# EasyEDA Pro project 智能家居1.eprj

# Schematic Smarthome
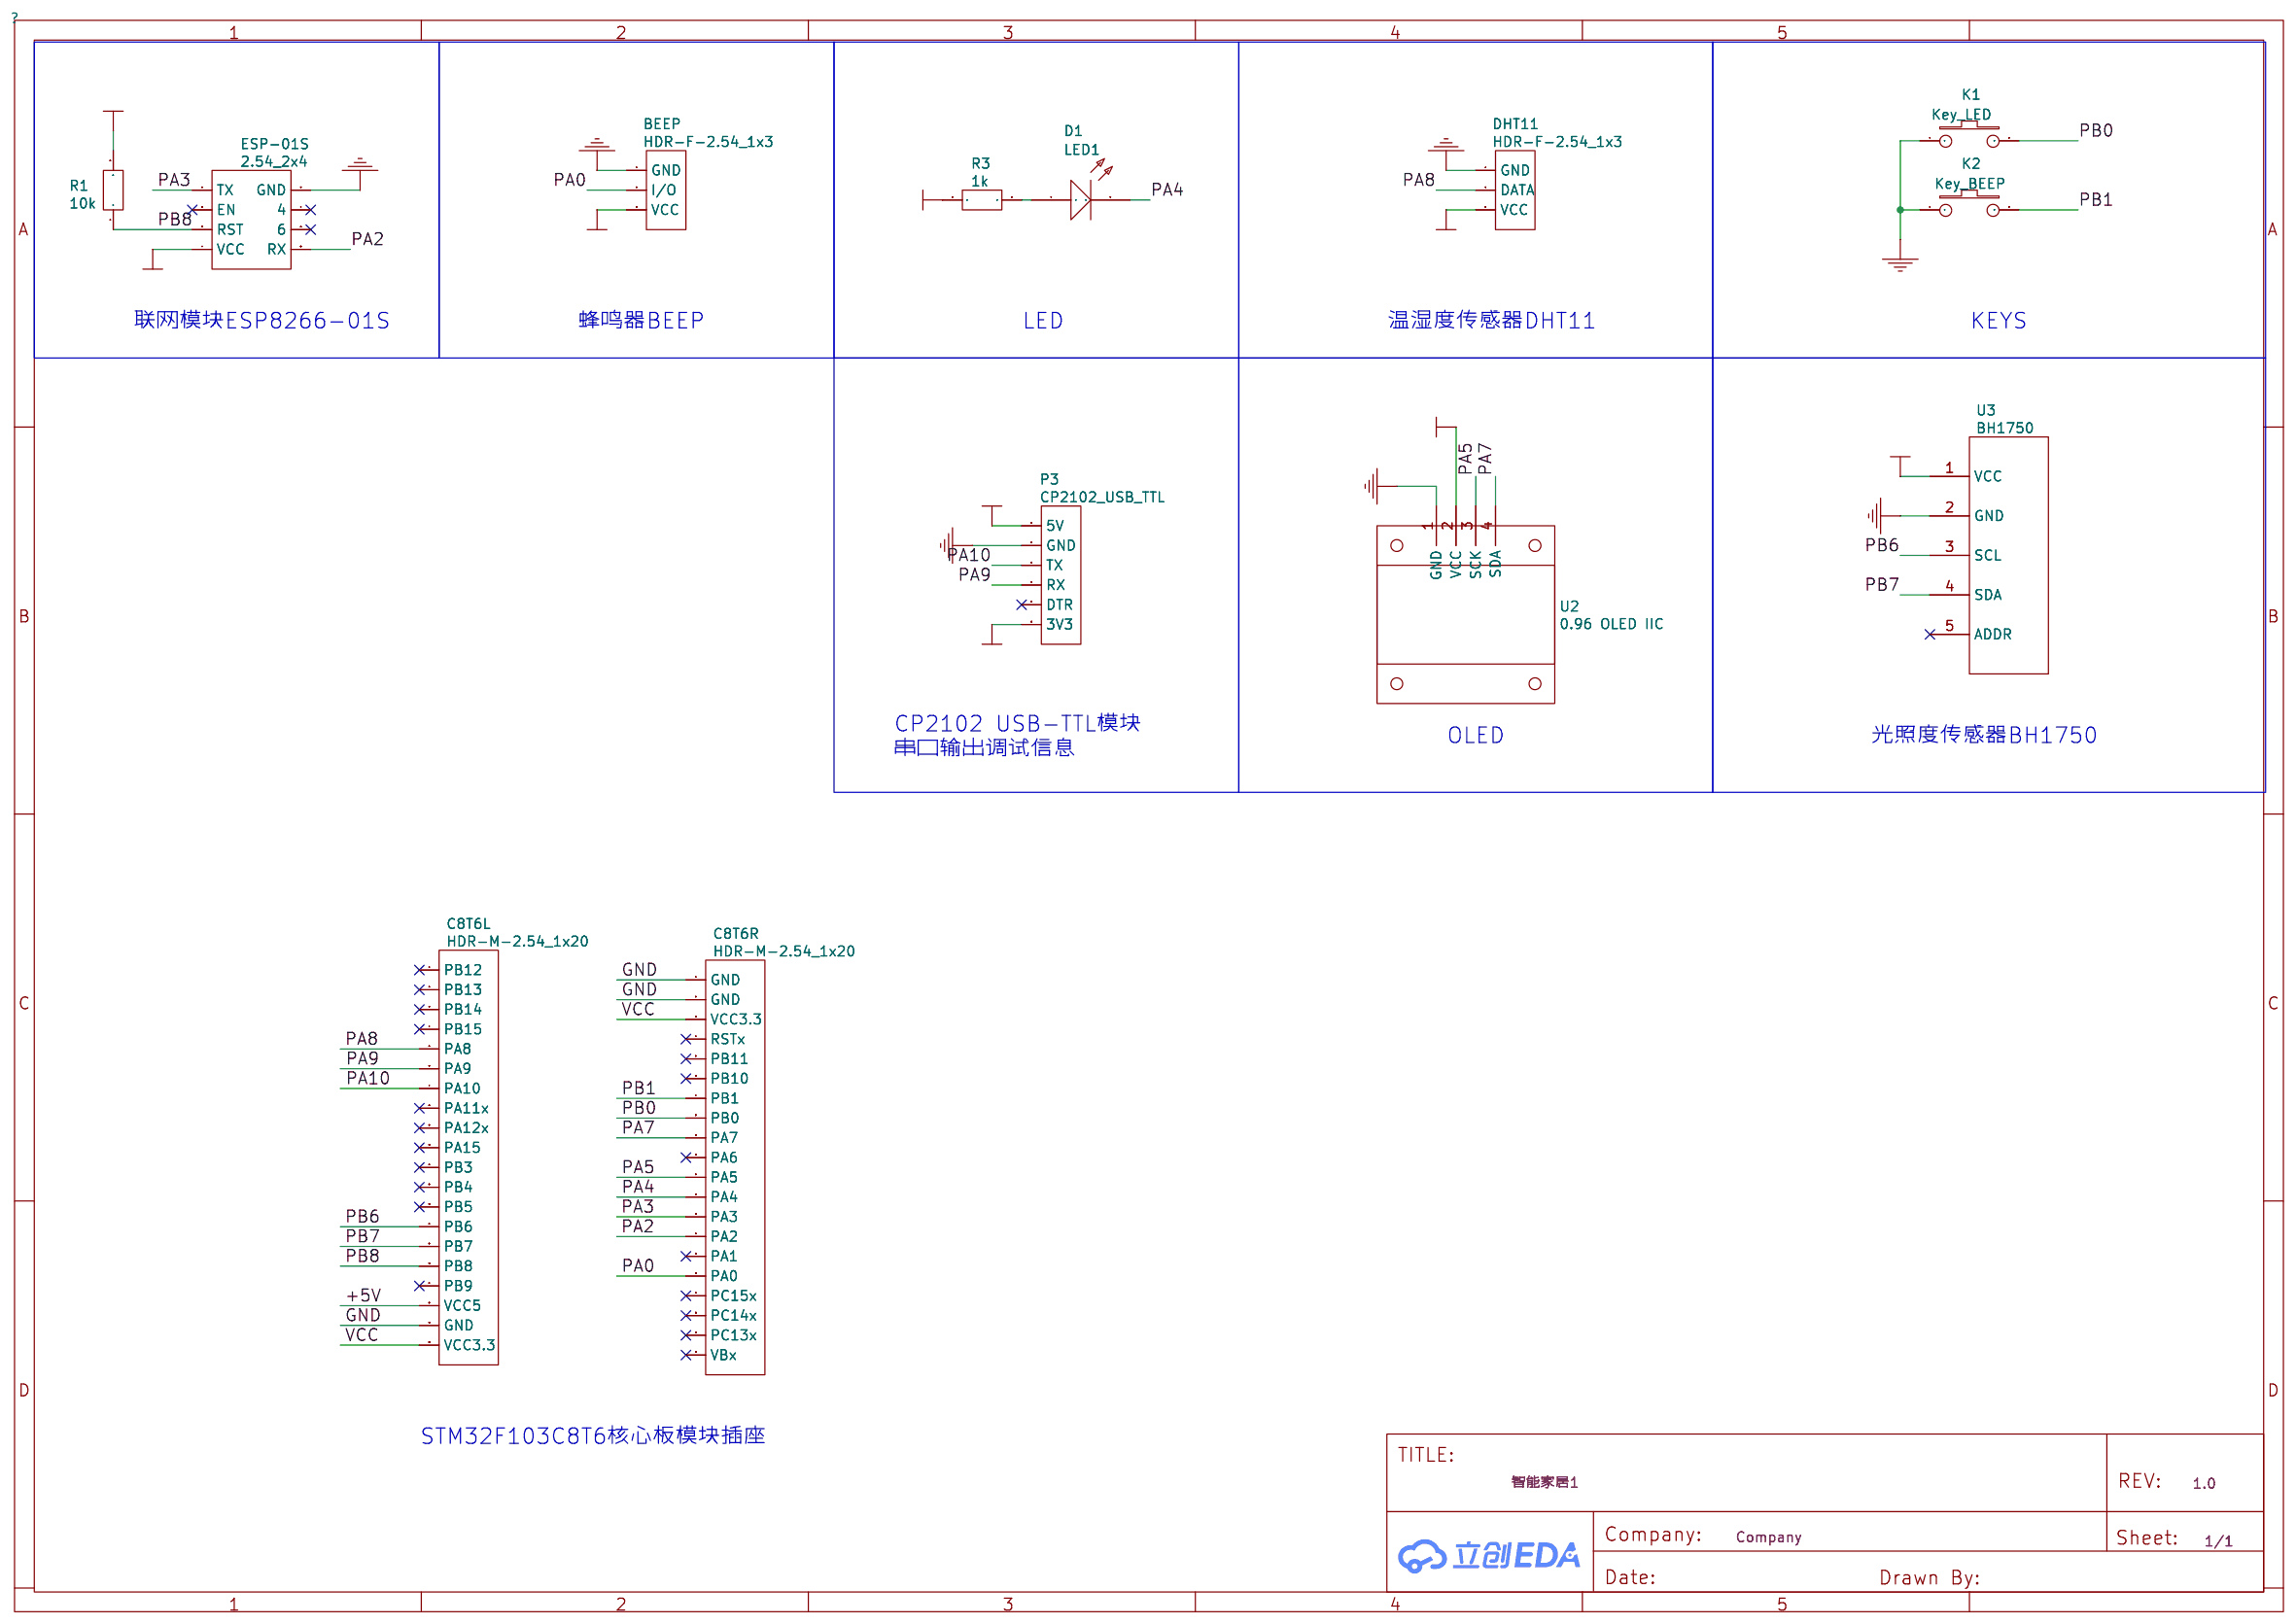
[diagram p0: schematic sheet]

## Parts
BEEP  HDR-F-2.54_1x3
C8T6L  HDR-M-2.54_1x20
C8T6R  HDR-M-2.54_1x20
D1  LED1
DHT11  HDR-F-2.54_1x3
ESP-01S  2.54_2x4
K1  Key_LED
K2  Key_BEEP
P3  CP2102_USB_TTL
R1  10k
R3  1k
U2  0.96 OLED IIC
U3  BH1750

## Library data of the parts
BEEP DHT11 = HDR-F-2.54_1x3: Supplier Part: C146690; Supplier: LCSC
C8T6L C8T6R = HDR-M-2.54_1x20: Supplier: LCSC; Manufacturer: BOOMELE; Manufacturer Part: 2.54mm 1*20P Female header; Supplier Part: C50984
D1 = LED1
ESP-01S = 2.54_2x4: Supplier Part: C239344; Supplier: LCSC
K1 = Key_LED
K2 = Key_BEEP
P3 = CP2102_USB_TTL: Supplier: LCSC; Manufacturer: BOOMELE; Manufacturer Part: Female header 1*6p; Supplier Part: C40877
R1 = 10k
R3 = 1k
U2 = 0.96 OLED IIC: Manufacturer Part: 0.96 OLED
U3 = BH1750

## Nets
+5V: C8T6L.18(VCC5) P3.1(5V)
GND: BEEP.1(GND) C8T6L.19(GND) C8T6R.1(GND) C8T6R.2(GND) DHT11.1(GND) ESP-01S.2(GND) K1.1 K2.1 P3.2(GND) U2.1(GND) U3.2(GND)
VCC: BEEP.3(VCC) C8T6L.20(VCC3.3) C8T6R.3(VCC3.3) DHT11.3(VCC) ESP-01S.7(VCC) P3.6(3V3) R1.2 R3.1 U2.2(VCC) U3.1(VCC)
PA0: BEEP.2(I/O) C8T6R.16(PA0)
PA2: C8T6R.14(PA2) ESP-01S.8(RX)
PA3: C8T6R.13(PA3) ESP-01S.1(TX)
PA4: C8T6R.12(PA4) D1.2(K)
PA5: C8T6R.11(PA5) U2.3(SCK)
PA7: C8T6R.9(PA7) U2.4(SDA)
PA8: C8T6L.5(PA8) DHT11.2(DATA)
PA9: C8T6L.6(PA9) P3.4(RX)
PA10: C8T6L.7(PA10) P3.3(TX)
PB0: C8T6R.8(PB0) K1.2
PB1: C8T6R.7(PB1) K2.2
PB6: C8T6L.14(PB6) U3.3(SCL)
PB7: C8T6L.15(PB7) U3.4(SDA)
PB8: C8T6L.16(PB8) ESP-01S.5(RST) R1.1
Net-(D1-1): D1.1(A) R3.2

Not connected (* = marked no-connect by the designer): C8T6L 1(PB12)* 2(PB13)* 3(PB14)* 4(PB15)* 8(PA11x)* 9(PA12x)* 10(PA15)* 11(PB3)* 12(PB4)* 13(PB5)* 17(PB9)*; C8T6R 4(RSTx)* 5(PB11)* 6(PB10)* 10(PA6)* 15(PA1)* 17(PC15x)* 18(PC14x)* 19(PC13x)* 20(VBx)*; ESP-01S 3(EN)* 4* 6*; P3 5(DTR)*; U3 5(ADDR)*

## Notes on the sheet
- 联网模块ESP8266-01S
- 蜂鸣器BEEP
- LED
- 温湿度传感器DHT11
- KEYS
- CP2102 USB-TTL模块
  串口输出调试信息
- OLED
- 光照度传感器BH1750
- STM32F103C8T6核心板模块插座

# Board eda_PCB_season1_v1.0
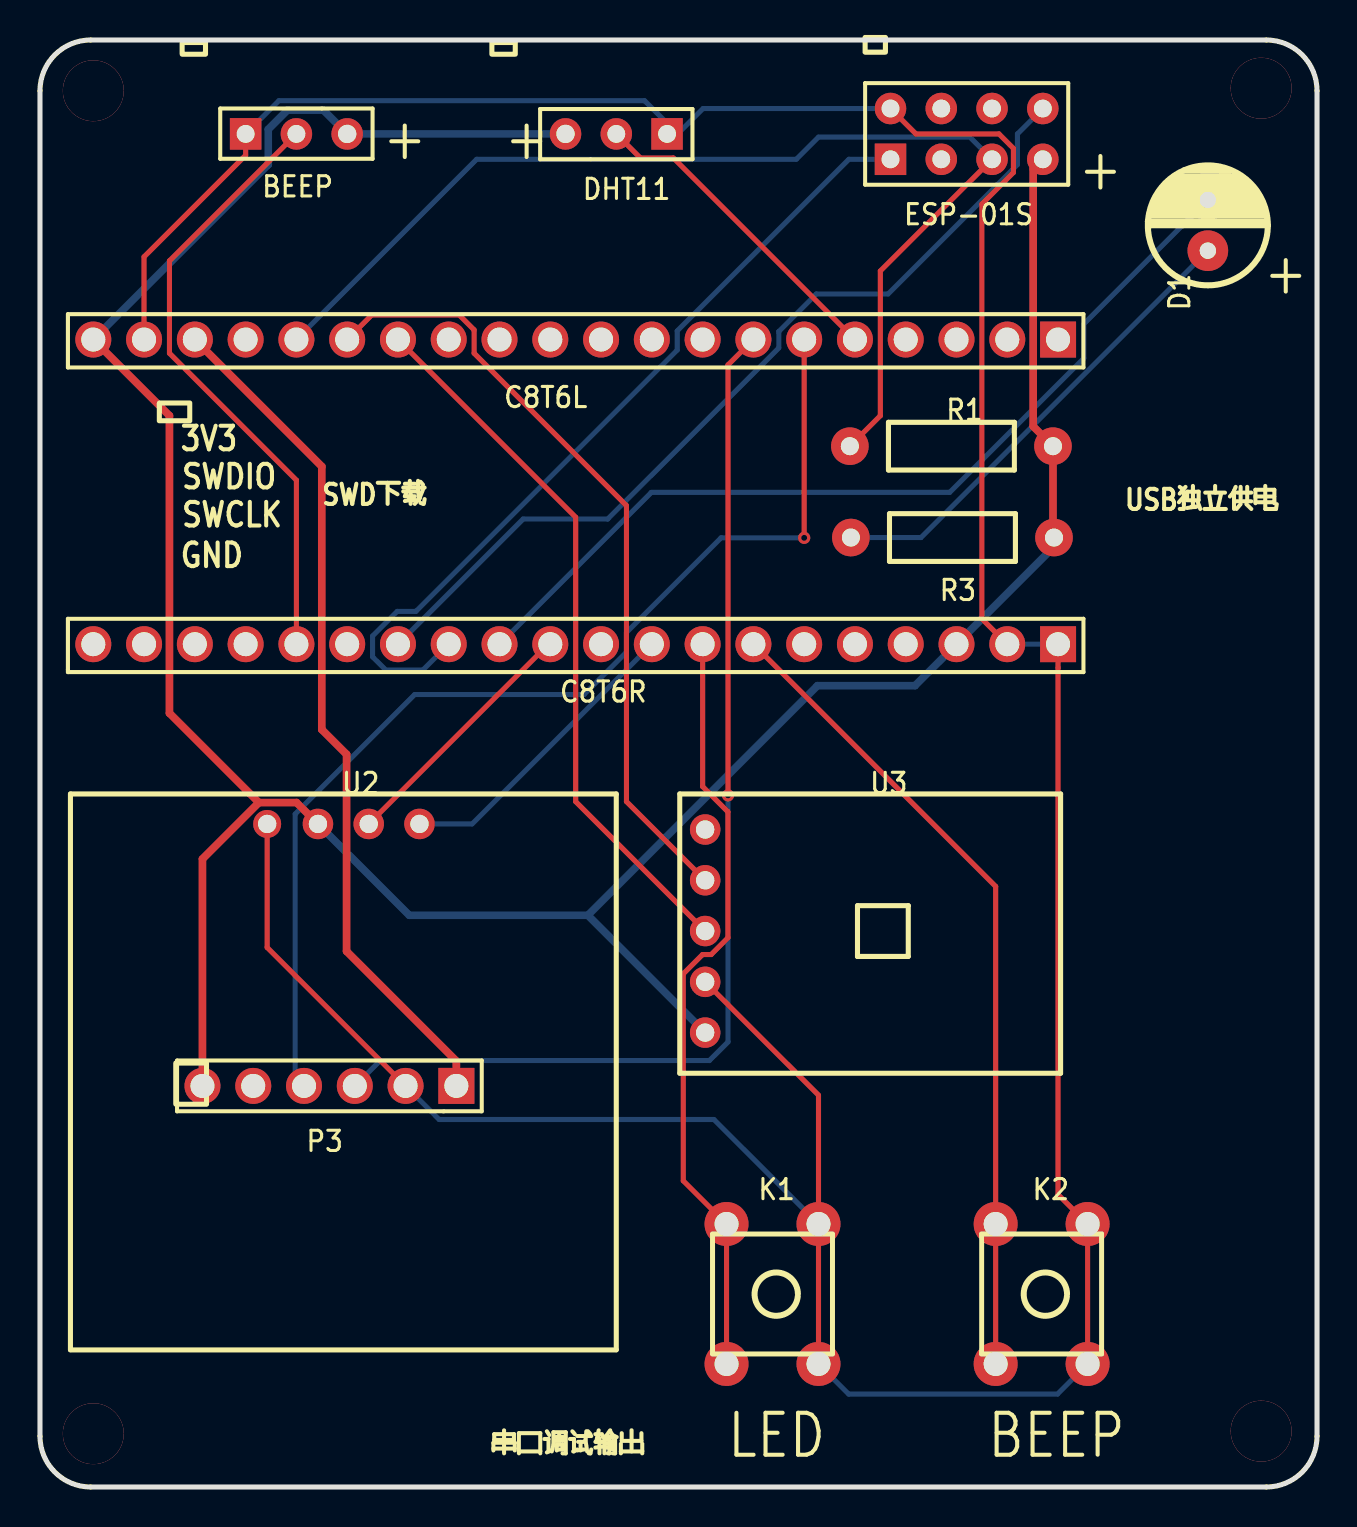
[diagram p1: board, top side]
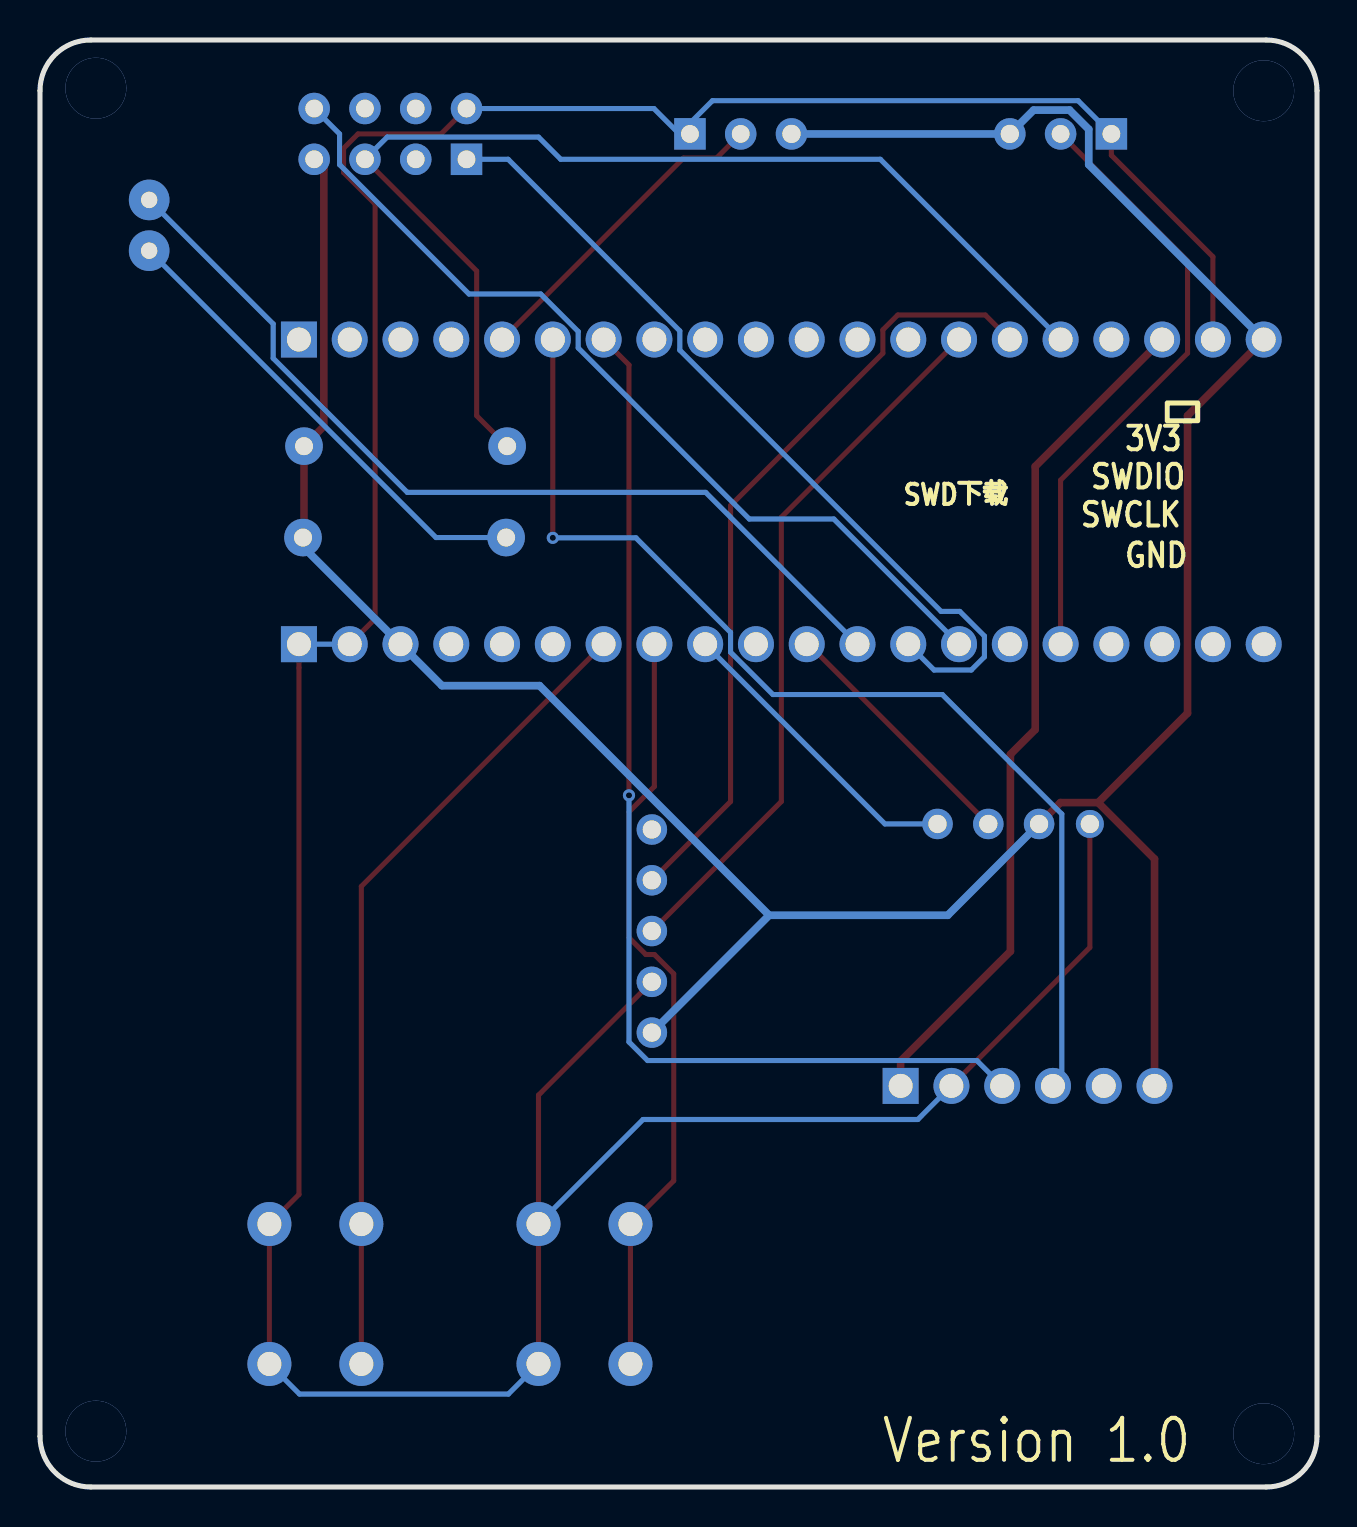
[diagram p2: board, bottom side, seen from below]

Outline 63.88 x 72.39 mm; copper layers: Top Layer, Bottom Layer. Coordinates in mm from the lower left corner of the outline.
Outline path: 0,69.85 arc(0.74,71.65) 2.54,72.39 61.34,72.39 arc(63.14,71.65) 63.88,69.85 63.88,2.54 arc(63.14,0.74) 61.34,0 2.54,0 arc(0.74,0.74) 0,2.54 0,69.85
Stack: Top Layer 0.035mm / Dielectric1 1.51mm FR4 er 4.5 / Bottom Layer 0.035mm

## Design rules (mm)
spacing Default (default): track to track 0.152, other pairs 0 to 0.152
spacing V: track to track 0.152, other pairs 0 to 0.152
track width Default (default): min 0.254, default 0.254, max 25.4
track width V: min 0.381, default 0.381, max 25.4
differential pair differentialPair (default): width min 0.127, default 0.254, max 2.54; gap min 0.152, default 0.152
via Default (default): diameter min 0.61, default 0.61, max 100.025; hole min 0.305, default 0.305, max 59.995
via V: diameter min 0.61, default 0.61, max 100.025; hole min 0.305, default 0.305, max 59.995
net VCC uses V
net +5V uses V
net GND uses gge2475(1)
pour e73 uses gge2475
pour e163 uses gge2475(1)

## Placement (name value [footprint] x y rotation side)
BEEP  HDR-F-2.54_1x3  [HDR-F-2.54_1X3]  12.83 67.69 0 top
C8T6L  HDR-M-2.54_1x20  [HDR-TH_20P-P2.54-V]  26.8 57.4 180 top
C8T6R  HDR-M-2.54_1x20  [HDR-TH_20P-P2.54-V]  26.8 42.16 180 top
D1  LED1  [LED5MM]  58.42 63.12 90 top
DHT11  HDR-F-2.54_1x3  [HDR-F-2.54_1X3]  28.83 67.69 180 top
ESP-01S  2.54_2x4  [HDR-F-2.54_2X4]  46.35 67.69 0 top
K1  Key_LED  [SWITCH4]  36.83 9.65 0 top
K2  Key_BEEP  [SWITCH4]  50.29 9.65 0 top
P3  CP2102_USB_TTL  [HDR-6X1/2.54]  14.48 20.07 180 top
R1  10k  [AXIAL-0.4]  45.59 52.07 0 top
R3  1k  [AXIAL-0.4]  45.64 47.5 180 top
U2  0.96 OLED IIC  [0.96寸OLED模块I2C]  1.52 34.67 0 top
U3  BH1750  [BH1750 (GY-302)]  33.27 32.89 0 top

## Footprints (pads in the part's own frame, mm; a bottom-side part is the same pattern mirrored in y, then rotated)
0.96寸OLED模块I2C
  round 1.4 hole 0.914: 1(9.84,-1.5)
  round 1.524 hole 0.914: 2(12.38,-1.5) 3(14.92,-1.5) 4(17.46,-1.5)
AXIAL-0.4
  round 1.879 hole 0.899: 1(-5.08,0) 2(5.08,0)
BH1750 (GY-302)
  round 1.524 hole 0.914: 1(0,-10.16) 2(0,-7.62) 3(0,-5.08) 4(0,-2.54) 5(0,0)
HDR-6X1/2.54
  rect 1.8x1.8 hole 1.2: 1(-6.35,0)
  round 1.8 hole 1.2: 2(-3.81,0) 3(-1.27,0) 4(1.27,0) 5(3.81,0) 6(6.35,0)
HDR-F-2.54_1X3
  rect 1.575x1.575 hole 0.889: 1(-2.54,0)
  round 1.575 hole 0.889: 2(0,0)
  round 1.575 hole 0.914: 3(2.54,0)
HDR-F-2.54_2X4
  rect 1.575x1.575 hole 0.889: 1(-3.81,-1.27)
  round 1.575 hole 0.889: 2(-3.81,1.27) 3(-1.27,-1.27) 4(-1.27,1.27) 5(1.27,-1.27) 6(1.27,1.27) 7(3.81,-1.27) 8(3.81,1.27)
HDR-TH_20P-P2.54-V
  rect 1.8x1.8 hole 1.2: 1(-24.13,0)
  round 1.8 hole 1.2: 2(-21.59,0) 3(-19.05,0) 4(-16.51,0) 5(-13.97,0) 6(-11.43,0) 7(-8.89,0) 8(-6.35,0) 9(-3.81,0) 10(-1.27,0) 11(1.27,0) 12(3.81,0) 13(6.35,0) 14(8.89,0) 15(11.43,0) 16(13.97,0) 17(16.51,0) 18(19.05,0) 19(21.59,0) 20(24.13,0)
LED5MM
  round 2.032 hole 0.818x0.813: 1(-1.27,0) 2(1.27,0)
SWITCH4
  round 2.2 hole 1.2x1.205: 1(2.114,3.505) 2(-2.486,-3.495) 3(2.114,-3.495) 4(-2.486,3.505)

## Nets
+5V: C8T6L.18 P3.1
GND: BEEP.1 C8T6L.19 C8T6R.1 C8T6R.2 DHT11.1 ESP-01S.2 K1.1 K1.3 K2.1 K2.3 P3.2 U2.1 U3.2
VCC: BEEP.3 C8T6L.20 C8T6R.3 DHT11.3 ESP-01S.7 P3.6 R1.2 R3.1 U2.2 U3.1
PA0: BEEP.2 C8T6R.16
PA2: C8T6R.14 ESP-01S.8
PA3: C8T6R.13 ESP-01S.1
PA4: C8T6R.12 D1.2
PA5: C8T6R.11 U2.3
PA7: C8T6R.9 U2.4
PA8: C8T6L.5 DHT11.2
PA9: C8T6L.6 P3.4
PA10: C8T6L.7 P3.3
PB0: C8T6R.8 K1.2 K1.4
PB1: C8T6R.7 K2.2 K2.4
PB6: C8T6L.14 U3.3
PB7: C8T6L.15 U3.4
PB8: C8T6L.16 ESP-01S.5 R1.1
R3_2: D1.1 R3.2

Pads without a net: C8T6L 1 2 3 4 8 9 10 11 12 13 17; C8T6R 4 5 6 10 15 17 18 19 20; ESP-01S 3 4 6; P3 5; U3 5

## Via types
v1: diameter 3.048, hole 3.048, Top Layer to Bottom Layer, 4 vias
v2: diameter 0.61, hole 0.305, Top Layer to Bottom Layer, 2 vias

## Routing (per net, layer and track width the routed paths; a pad name or vN(x,y) marks a point on that pad's centre or on a via; arc(x,y) is an arc through that point)
+5V: length 42.8
  Top Layer w0.381: P3.1 20.83,21.31 15.34,26.8 15.34,36.65 14.1,37.89 14.1,51.05 C8T6L.18
GND: length 194.9
  Top Layer w0.254: ESP-01S.2 43.81,67.69 47.97,67.69 48.69,66.97 48.69,65.76 47.12,64.18 47.12,43.43 C8T6R.2 ; K1.3 K1.1 38.94,19.6 U3.2 ; C8T6R.1 50.93,14.64 K2.1 K2.3 ; P3.2 11.36,26.99 U2.1 ; C8T6L.19 5.21,61.54 10.29,66.62 BEEP.1
  Bottom Layer w0.254: K1.1 33.72,18.39 19.97,18.39 P3.2 ; DHT11.1 31.9,67.69 ; 31.9,67.69 33.17,68.96 ESP-01S.2 ; 31.9,67.69 30.24,69.35 11.95,69.35 BEEP.1 ; K2.3 50.9,4.65 40.45,4.65 K1.3 ; C8T6R.1 C8T6R.2
VCC: length 149.9
  Top Layer w0.381: 10.95,34.24 12.84,34.24 U2.2 ; 10.95,34.24 6.48,38.71 6.48,53.59 C8T6L.20 ; 10.95,34.24 8.13,31.42 P3.6 ; R3.1 50.67,47.55 R1.2 49.68,53.06 49.68,65.94 ESP-01S.7
  Bottom Layer w0.381: 27.41,28.6 38.89,40.09 43.77,40.09 C8T6R.3 50.72,47.04 R3.1 ; 27.41,28.6 U3.1 ; 27.41,28.6 18.47,28.6 U2.2 ; C8T6L.20 11.42,66.16 11.42,67.92 12.38,68.88 14.18,68.88 BEEP.3 26.29,67.69
(no net):
  vias: v1(2.67,69.85) v1(2.67,2.67) v1(61.09,69.98) v1(61.09,2.79)
PA0: length 30.8
  Top Layer w0.254: BEEP.2 6.48,61.34 6.48,56.72 12.83,50.37 C8T6R.16
PA2: length 44.7
  Bottom Layer w0.254: 17.91,42.16 24.17,48.43 28.4,48.43 36.96,56.99 36.96,57.81 38.83,59.68 42.42,59.68 48.9,66.16 48.9,67.69 ESP-01S.8
PA3: length 42
  Bottom Layer w0.254: C8T6R.13 19.16,40.87 17.29,40.87 16.64,41.53 16.64,42.57 17.87,43.8 18.8,43.8 31.88,56.88 31.88,57.84 40.46,66.42 ESP-01S.1
PA4: length 45.6
  Bottom Layer w0.254: D1.2 52.22,58.18 52.22,56.47 45.51,49.76 30.58,49.76 C8T6R.12
PA5: length 12.8
  Top Layer w0.254: C8T6R.11 25.44,42.16 U2.3
PA7: length 15.3
  Bottom Layer w0.254: U2.4 21.61,33.17 C8T6R.9
PA8: length 16.2
  Top Layer w0.254: C8T6L.5 31.69,66.49 30.03,66.49 DHT11.2
PA9: length 55.5
  Top Layer w0.254: v2(38.23,47.48) C8T6L.6
  Bottom Layer w0.254: v2(38.23,47.48) 34.07,47.48 29.34,42.75 29.34,41.76 27.22,39.64 18.74,39.64 12.77,33.67 12.77,20.51 P3.4
PA10: length 55.2
  Top Layer w0.254: C8T6L.7 34.42,56.13 v2(34.42,34.6)
  Bottom Layer w0.254: v2(34.42,34.6) 34.42,22.26 33.49,21.33 17.02,21.33 P3.3
PB0: length 38.6
  Top Layer w0.254: K1.2 K1.4 32.18,15.32 32.18,25.67 33.15,26.64 33.58,26.64 34.41,27.48 34.41,33.78 33.15,35.04 C8T6R.8
PB1: length 41
  Top Layer w0.254: K2.2 K2.4 47.81,30.05 C8T6R.7
PB6: length 36
  Top Layer w0.254: U3.3 26.8,34.29 26.8,48.51 17.91,57.4
PB7: length 39.5
  Top Layer w0.254: U3.4 29.34,34.29 29.34,49.1 21.72,56.72 21.72,57.89 20.97,58.63 16.59,58.63 C8T6L.15
PB8: length 56.8
  Top Layer w0.254: ESP-01S.5 42.04,60.83 42.04,53.59 R1.1
  Bottom Layer w0.254: C8T6L.16 21.84,66.42 37.83,66.42 38.94,67.53 46.51,67.53 ESP-01S.5
R3_2: length 23.8
  Bottom Layer w0.254: D1.1 44.07,47.5 R3.2

## Copper pours and planes (outline as drawn; the poured copper is in the pictures)
GND on Top Layer: -1.4,73.41 -1.4,-2.03 65.41,-2.03 65.53,-1.91 65.53,73.41
GND on Bottom Layer: -0.76,74.42 -0.76,-1.02 66.04,-1.02 66.17,-0.89 66.17,74.42

## Text on the board
Bottom Silkscreen Layer: 3V3 | GND | SWDIO | SWCLK | Version 1.0 | SWD下载
Top Silkscreen Layer: 3V3 | GND | SWDIO | SWCLK | + | LED | BEEP | SWD下载 | 串口调试输出 | USB独立供电
